# Altium schematic sheet 枪盒主板-20201219.SchDoc
size A1
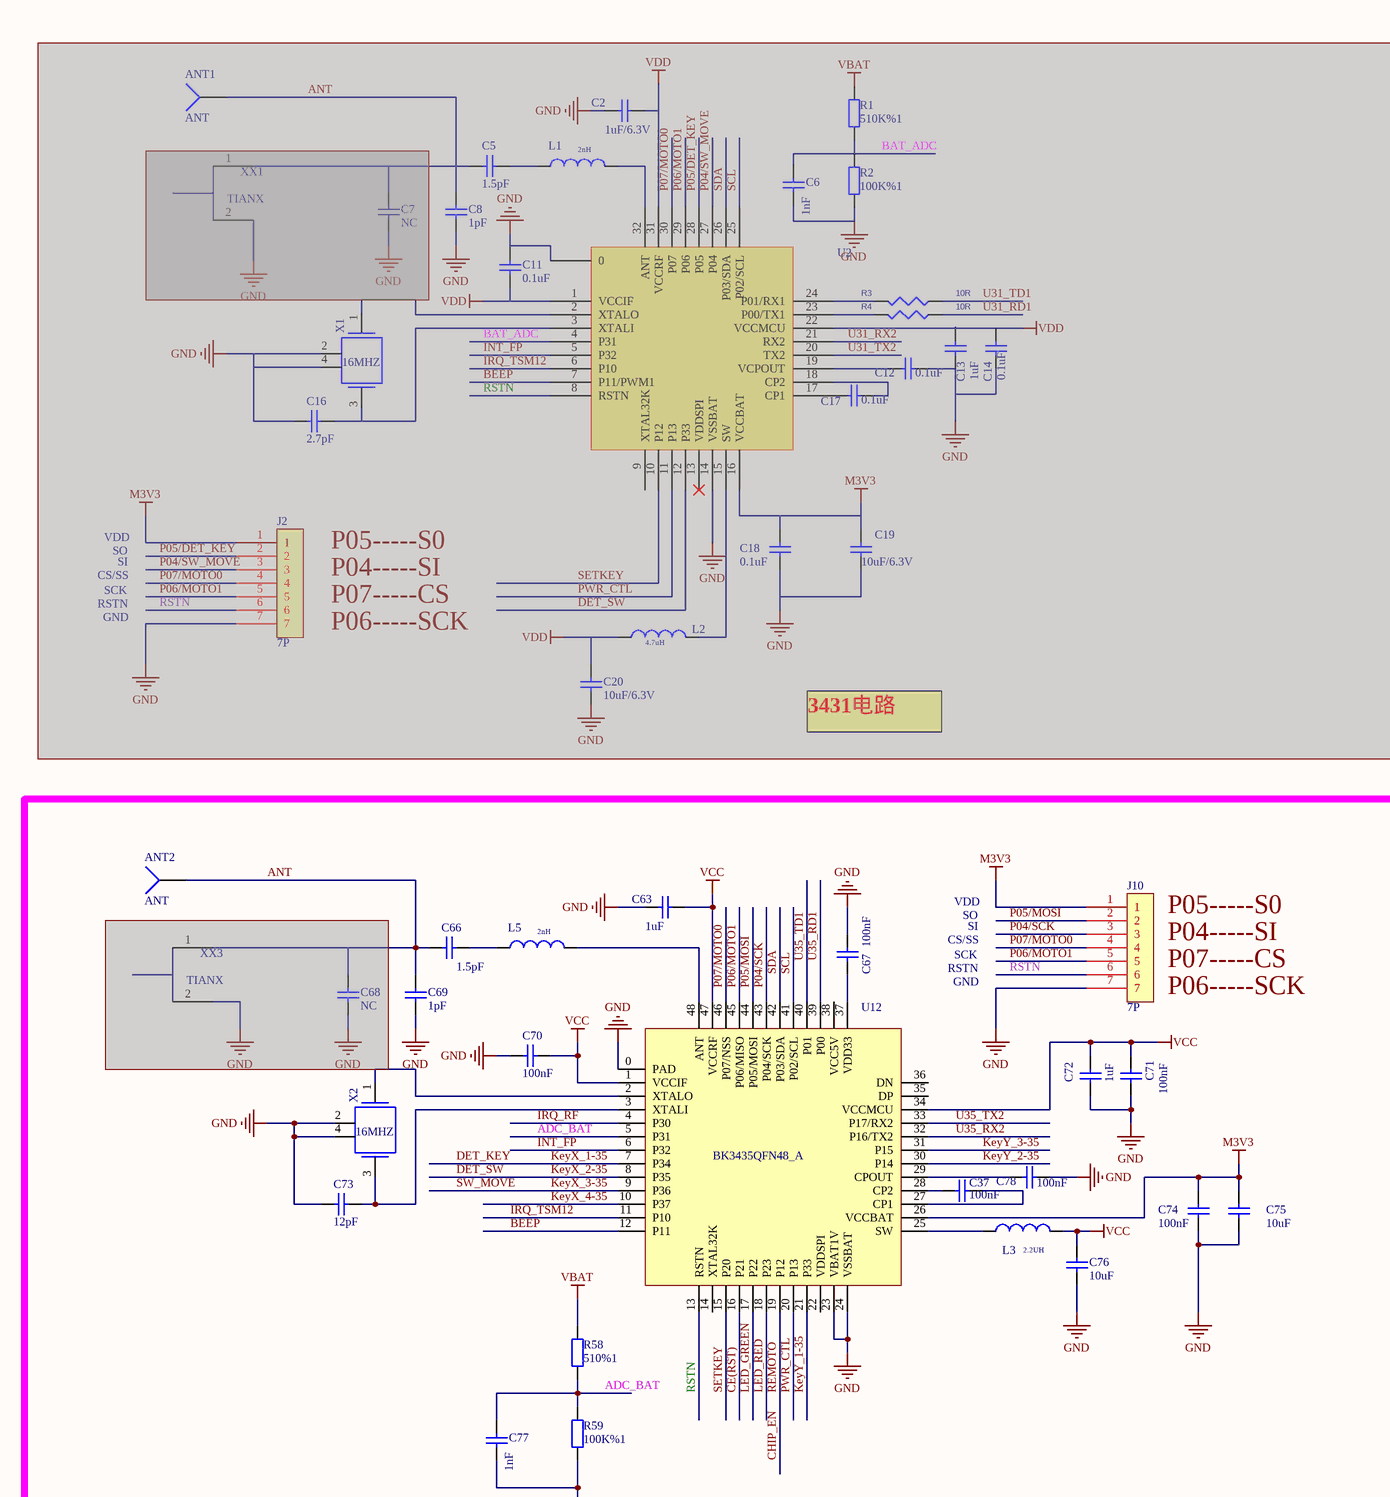
[diagram p0: 枪盒主板-20201219.SchDoc, top left]
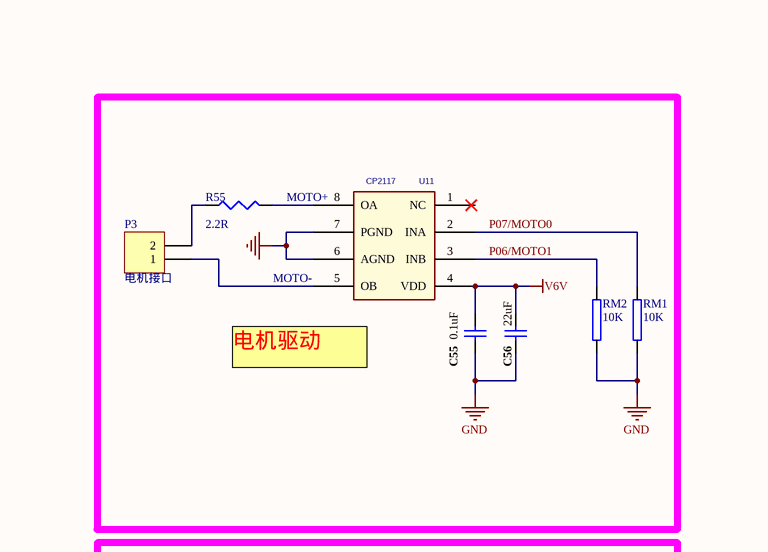
[diagram p1: 枪盒主板-20201219.SchDoc, top right]
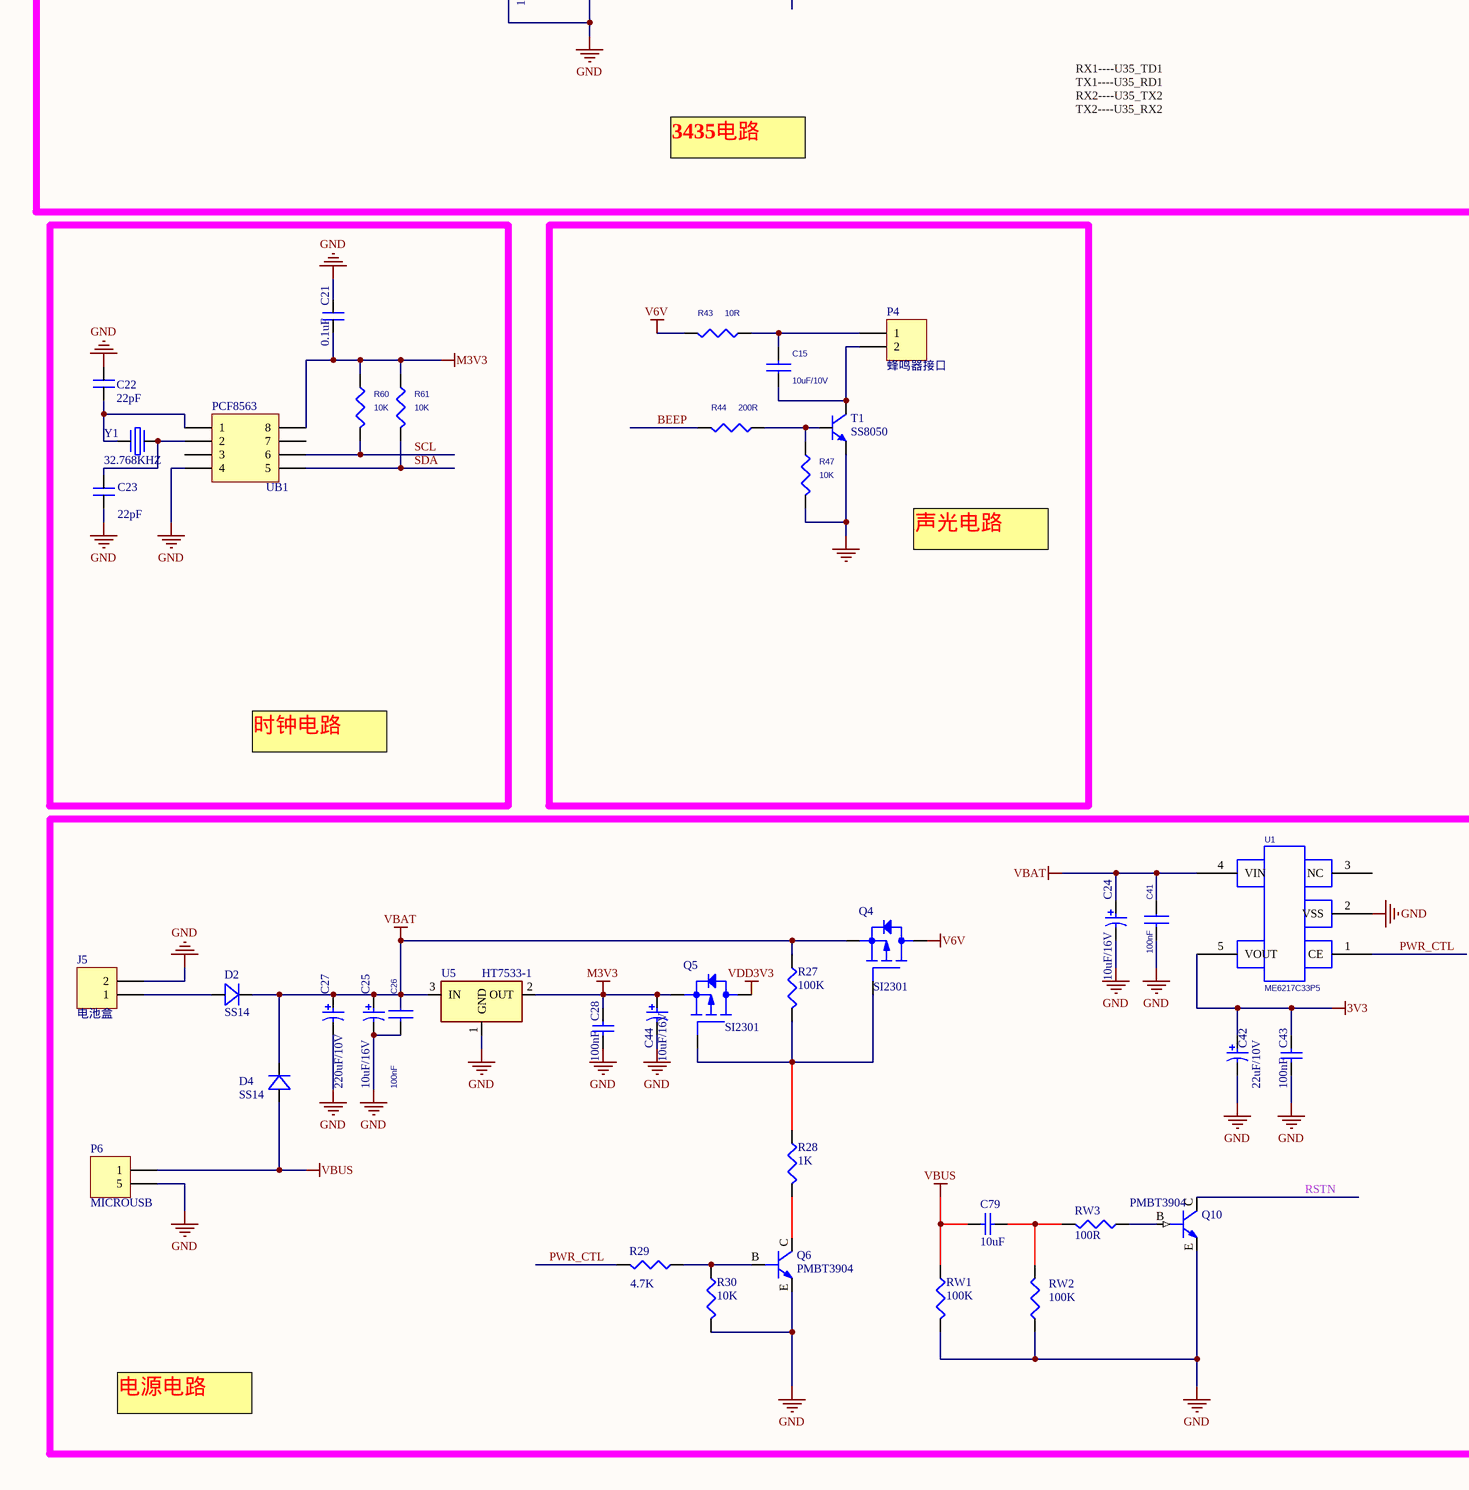
[diagram p2: 枪盒主板-20201219.SchDoc, bottom left]
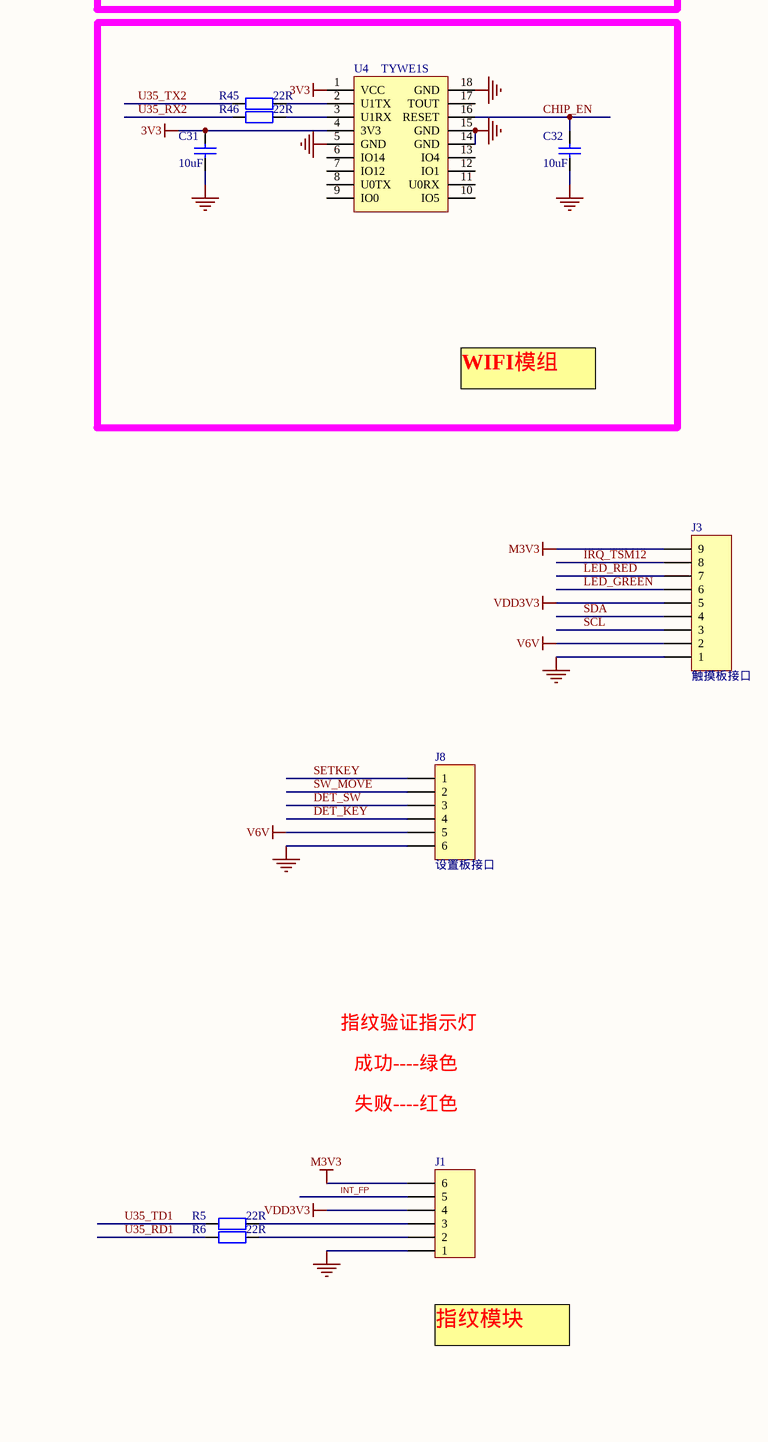
[diagram p3: 枪盒主板-20201219.SchDoc, bottom right]

## Parts
ANT1  ANT  [ANT]  (masked out: inside a compile mask, not in the netlist)
ANT2  ANT  [ANT]
C2  1uF/6.3V  [0603C]  (masked out: inside a compile mask, not in the netlist)
C5  1.5pF  [0603C]  (masked out: inside a compile mask, not in the netlist)
C6  1nF  [0603C]  (masked out: inside a compile mask, not in the netlist)
C7  NC  [0603C]  (masked out: inside a compile mask, not in the netlist)
C8  1pF  [0603C]  (masked out: inside a compile mask, not in the netlist)
C11  0.1uF  [0603C]  (masked out: inside a compile mask, not in the netlist)
C12  0.1uF  [0603C]  (masked out: inside a compile mask, not in the netlist)
C13  1uF  [0603C]  (masked out: inside a compile mask, not in the netlist)
C14  0.1uF  [0603C]  (masked out: inside a compile mask, not in the netlist)
C15  10uF/10V  [0603C]
C16  2.7pF  [0603C]  (masked out: inside a compile mask, not in the netlist)
C17  0.1uF  [0603C]  (masked out: inside a compile mask, not in the netlist)
C18  0.1uF  [0603C]  (masked out: inside a compile mask, not in the netlist)
C19  10uF/6.3V  [0603C]  (masked out: inside a compile mask, not in the netlist)
C20  10uF/6.3V  [0603C]  (masked out: inside a compile mask, not in the netlist)
C21  0.1uF  [0603C]
C22  22pF  [0603C]
C23  22pF  [0603C]
C24  10uF/16V  [0805C]
C25  10uF/16V  [0805C]
C26  100nF  [0603C]
C27  220uF/10V  [0805C]
C28  100nF  [0603C]
C31  10uF  [0603C]
C32  10uF  [0603C]
C37  100nF  [0603C]
C41  100nF  [0603C]
C42  22uF/10V  [0805C]
C43  100nF  [0603C]
C44  10uF/16V  [0805C]
C55  0.1uF  [0603C]
C56  22uF  [0805C]
C63  1uF  [0603C]
C66  1.5pF  [0603C]
C67  100nF  [0603C]
C68  NC  [0603C]  (masked out: inside a compile mask, not in the netlist)
C69  1pF  [0603C]
C70  100nF  [0603C]
C71  100nF  [0603C]
C72  1uF  [0603C]
C73  12pF  [0603C]
C74  100nF  [0603C]
C75  10uF  [0603C]
C76  10uF  [0603C]
C77  1nF  [0603C]
C78  100nF  [0603C]
C79  10uF  [0603C]
D2  SS14  [DO-214AA]
D4  SS14  [DO-214AA]
J1  (no value)  [SM06B-SRSS-TB]
J2  7P  [7P-2.0MM]  (masked out: inside a compile mask, not in the netlist)
J3  触摸板接口  [FPC-0.5-9P]
J5  电池盒  [B2B-PH]
J8  设置板接口  [6P-1mm]
J10  7P  [7P-2.0MM]
L1  2nH  [0603L]  (masked out: inside a compile mask, not in the netlist)
L2  4.7uH  [0603L]  (masked out: inside a compile mask, not in the netlist)
L3  2.2UH  [0603L]
L5  2nH  [0603L]
P3  电机接口  [B2B-PH]
P4  蜂鸣器接口  [B2B-PH]
P6  MICROUSB  [MICRO-USB_F-B]
Q4  SI2301  [SOT-23 - GDS]
Q5  SI2301  [SOT-23 - GDS]
Q6  PMBT3904  [SOT-23 - BCE]
Q10  PMBT3904  [SOT-23 - BCE]
R1  510K%1  [0603R]  (masked out: inside a compile mask, not in the netlist)
R2  100K%1  [0603R]  (masked out: inside a compile mask, not in the netlist)
R3  10R  [0603R]  (masked out: inside a compile mask, not in the netlist)
R4  10R  [0603R]  (masked out: inside a compile mask, not in the netlist)
R5  22R  [0603R]
R6  22R  [0603R]
R27  100K  [0603R]
R28  1K  [0603R]
R29  4.7K  [0603R]
R30  10K  [0603R]
R43  10R  [0603R]
R44  200R  [0603R]
R45  22R  [0603R]
R46  22R  [0603R]
R47  10K  [0603R]
R55  2.2R  [0603R]
R58  510%1  [0603R]
R59  100K%1  [0603R]
R60  10K  [0603R]
R61  10K  [0603R]
RM1  10K  [0603R]
RM2  10K  [0603R]
RW1  100K  [0603R]
RW2  100K  [0603R]
RW3  100R  [0603R]
T1  SS8050  [SOT-23-3L]
U1  ME6217C33P5  [LC-SOT-89-5]
U2  BK3431Q  [QFN32_4*4*0.4]  (value not drawn)  (masked out: inside a compile mask, not in the netlist)
U4  TYWE1S  [WIFI_Module_TYWE1S]
U5  HT7533-1  [SOT-23-3L]
U11  CP2117  [SOP8]
U12  BK3435QFN48_A  [QFN48_6*6*0.4]
UB1  PCF8563  [SOP8]
X1  16MHZ  [XTAL3225]  (masked out: inside a compile mask, not in the netlist)
X2  16MHZ  [XTAL3225]
XX1  TIANX  [BT_NAMI_1]  (masked out: inside a compile mask, not in the netlist)
XX3  TIANX  [BT_NAMI_1]
Y1  32.768KHZ  [晶振-9]

## Nets
3V3: C31.2 C42.1 C43.1 U1.5(VOUT) U4.1(VCC) U4.4(3V3)
GND: C21.2 C22.2 C23.1 C24.2 C25.2 C26.2 C27.2 C28.2 C31.1 C32.1 C41.2 C42.2 C43.2 C44.2 C55.2 C56.2 C63.1 C67.2 C69.1 C70.1 C71.1 C72.1 C73.1 C74.2 C75.2 C76.1 C77.1 C78.2 J1.1 J3.1 J5.2 J8.6 J10.7 P6.5 Q6.E(EMITTER) Q10.E(EMITTER) R30.2 R47.2 R59.2 RM1.1 RM2.1 RW1.2 RW2.1 T1.2 U1.2(VSS) U4.5(GND) U4.14(GND) U4.15(GND) U4.18(GND) U5.1(GND) U11.6(AGND) U11.7(PGND) U12.0(PAD) U12.23(VBAT1V) U12.24(VSSBAT) UB1.4 X2.2 X2.4
M3V3: C21.1 C28.1 C44.1 C74.1 C75.1 J1.6 J3.9 J10.1 Q5.S(SOURCE) R60.1 R61.1 U5.2(OUT) U12.26(VCCBAT) UB1.8
V6V: C55.1 C56.1 J3.2 J8.5 Q4.D(DRAIN) R43.2 U11.4(VDD)
VBAT: C24.1 C25.1 C26.1 C27.1 C41.1 D2.2(K) D4.2(K) Q4.S(SOURCE) R27.1 R58.1 U1.4(VIN) U5.3(IN)
VBUS: C79.1 D4.1(A) P6.1 RW1.1
VCC: C63.2 C70.2 C71.2 C72.2 C76.2 L3.2(P2) U12.1(VCCIF) U12.34(VCCMCU) U12.47(VCCRF)
VDD3V3: J1.4 J3.5 Q5.D(DRAIN)
ADC_BAT: C77.2 R58.2 R59.1 U12.5(P31)
ANT: ANT2.1 C66.2 C69.2 XX3.1
BEEP: R44.2 U12.12(P11)
CE(RST): U12.16(P21)
CHIP_EN: C32.2 U4.16(RESET) U12.19(P12)  [also labelled REMOTO]
DET_KEY: J8.4 U12.7(P34)  [also labelled KeyX_1-35]
DET_SW: J8.3 U12.8(P35)  [also labelled KeyX_2-35]
INT_FP: J1.5 U12.6(P32)
IRQ_RF: U12.4(P30)
IRQ_TSM12: J3.8 U12.11(P10)
KeyX_3-35: J8.2 U12.9(P36)  [also labelled SW_MOVE]
KeyX_4-35: U12.10(P37)
KeyY_1-35: U12.21(P33)
KeyY_2-35: U12.30(P14)
KeyY_3-35: U12.31(P15)
LED_GREEN: J3.6 U12.17(P22)
LED_RED: J3.7 U12.18(P23)
MOTO+: R55.2 U11.8(OA)
MOTO-: P3.1 U11.5(OB)
P04/SCK: J10.3 U12.43(P04/SCK)
P05/MOSI: J10.2 U12.44(P05/MOSI)
P06/MOTO1: J10.5 RM2.2 U11.3(INB) U12.45(P06/MISO)
P07/MOTO0: J10.4 RM1.2 U11.2(INA) U12.46(P07/NSS)
PWR_CTL: R29.2 U1.1(CE) U12.20(P13)
RSTN: J10.6 Q10.C(COLLECTOR) U12.13(RSTN)
SCL: J3.3 R60.2 U12.41(P02/SCL) UB1.6
SDA: J3.4 R61.2 U12.42(P03/SDA) UB1.5
SETKEY: J8.1 U12.15(P20)
U35_RD1: R6.1 U12.39(P00)
U35_RX2: R46.1 U12.32(P16/TX2)
U35_TD1: R5.1 U12.40(P01)
U35_TX2: R45.1 U12.33(P17/RX2)
NetC15_1: C15.1 P4.2 T1.3
NetC15_2: C15.2 P4.1 R43.1
NetC22_1: C22.1 UB1.1 Y1.2
NetC23_2: C23.2 UB1.2 Y1.1
NetC37_1: C37.1 U12.28(CP2)
NetC37_2: C37.2 U12.27(CP1)
NetC66_1: C66.1 L5.1(P1)
NetC67_1: C67.1 U12.37(VDD33)
NetC73_2: C73.2 U12.3(XTALI) X2.3
NetC78_1: C78.1 U12.29(CPOUT)
NetC79_2: C79.2 RW2.2 RW3.2
NetD2_1: D2.1(A) J5.1
NetJ1_2: J1.2 R6.2
NetJ1_3: J1.3 R5.2
NetL3_1: L3.1(P1) U12.25(SW)
NetL5_2: L5.2(P2) U12.48(ANT)
NetP3_2: P3.2 R55.1
NetQ4_G: Q4.G(GATE) Q5.G(GATE) R27.2 R28.1
NetQ6_B: Q6.B(BASE) R29.1 R30.1
NetQ6_C: Q6.C(COLLECTOR) R28.2
NetQ10_B: Q10.B(BASE) RW3.1
NetR44_1: R44.1 R47.1 T1.1
NetR45_2: R45.2 U4.2(U1TX)
NetR46_2: R46.2 U4.3(U1RX)
NetU12_2: U12.2(XTALO) X2.1

Not connected (* = marked no-connect by the designer): U1 3(NC); U4 6(IO14) 7(IO12) 8(U0TX) 9(IO0) 10(IO5) 11(U0RX) 12(IO1) 13(IO4) 17(TOUT); U11 1(NC); U12 14(XTAL32K) 22(VDDSPI) 35(DP) 36(DN) 38(VCC5V); UB1 3 7; XX3 2

## Notes on the sheet
- CS/SS
- VDD
- SO
- SI
- P04-----SI
- P05-----S0
- RSTN
- GND
- SCK
- P06-----SCK
- P07-----CS
- 3431电路
- (near J10) P05-----S0
- (near J10) P04-----SI
- (near J10) P07-----CS
- (near J10) P06-----SCK
- (near U11) 电机驱动
- RX1----U35_TD1
- TX1----U35_RD1
- RX2----U35_TX2
- TX2----U35_RX2
- 3435电路
- WIFI模组
- 声光电路
- 时钟电路
- 指纹验证指示灯
- 成功----绿色
- 失败----红色
- 指纹模块
- 电源电路

## Library data of the parts
ANT1 ANT2 = Socket: LatestRevisionDate: 17-Jul-2002; LatestRevisionNote: Re-released for DXP Platform.; Publisher: Altium Limited
C2 C5 C7 C8 C11-C14 C16-C20 C37 C63 C66-C76 C78 = Cap: Capacitor; Value: 10pF; Published: 8-Jun-2000; LatestRevisionDate: 17-Jul-2002; LatestRevisionNote: Re-released for DXP Platform.; PackageReference: RAD-0.3; Publisher: Altium Limited; PackageDescription: Radial Cap, Thru-Hole; 2 Leads; 0.3 in Pin Spacing
C6 C28 C43 C55 C56 C77 C79 = CAP-NP: Capacitor, Ceramic; Capacitance: 18 pF; Dielectric: COG; Polarity: Non-Polarized; Rated Voltage: 50 mV; Tolerance: 5 %; Category: Capacitor; Mounting Technology: Surface Mount; Status: Unreleased; Technology: Ceramic
C15 = C_0_Dup1
C21-C23 = C
C24 C25 C27 C42 C44 = CAP-P: Capacitor, tolerance ±20%
C26 C41 = CAP NP
C31 C32 = Cap: 10uF/6.3V X5R ±20%; Published: 8-Jun-2000; LatestRevisionDate: 17-Jul-2002; LatestRevisionNote: Re-released for DXP Platform.; PackageReference: RAD-0.3; Publisher: Altium Limited; PackageDescription: Radial Cap, Thru-Hole; 2 Leads; 0.3 in Pin Spacing; Value: 10UF
D2 D4 = D
J1 = Con_SMD_125L_6: Connecter 1.25 SMD lie; Class: Connector; PN: 080101250061; SubClass: 连接器; Model: 1.25 SMD卧式插座
J3 = Header 9: Header,9-Pin; LatestRevisionDate: 17-Jul-2002; LatestRevisionNote: Re-released for DXP Platform.; Publisher: Altium Limited
J5 = Header 2: Header, 2-Pin; LatestRevisionDate: 17-Jul-2002; LatestRevisionNote: Re-released for DXP Platform.; Publisher: Altium Limited
J8 = Header 6: Header, 6-Pin; LatestRevisionDate: 17-Jul-2002; LatestRevisionNote: Re-released for DXP Platform.; Publisher: Altium Limited
L1-L3 L5 = INDUCTOR: Power Inductor, 4.7uH, 0.7A, 260mR DCR; XMOS Part Number: E-09-0011; Manufacturer: Taiyo Yuden; Manufacturer Part Number: CBC2518T4R7M; Part Creator: JG; LEVEL: STD; DEVICE: L; FORWARD_PCB: 1; Tolerance (%): 20; Max DC Resistance: 0.26R; Rated Current (Saturation): 0.68A; Rated Current (Temp Rise): 0.92A; Approx Volume Cost ($): 0.07; Approved: NO; VALUE: 2.0nH; Datasheet: http://www.yuden.co.jp/us/product/pdf/ecb2_e.pdf; Max Height (mm): 2; Digikey Link: http://search.digikey.com/scripts/DkSearch/dksus.dll?lang=en&site=US&keywords=CBC2518T4R7M
P3 P4 P6 = MHDR1X2: Header, 2-Pin; LatestRevisionDate: 17-Jul-2002; LatestRevisionNote: Re-released for DXP Platform.; Publisher: Altium Limited
Q4 Q5 = PWRMOSFET_EP_DGS_0
R1 R2 R58 R59 = Res2: Resistor; Value: 470K; Published: 2013年12月24日; LatestRevisionDate: 2013年12月24日; LatestRevisionNote: Re-released for DXP Platform.
R3 R4 R43 R44 R47 R60 R61 = R_Dup1
R5 R6 R45 R46 = Res2: Resistor; Published: 8-Jun-2000; LatestRevisionDate: 17-Jul-2002; LatestRevisionNote: Re-released for DXP Platform.; PackageReference: AXIAL-0.4; Publisher: Altium Limited; PackageDescription: Axial Device, Thru-Hole; 2 Leads; 0.4 in Pin Spacing; Value: 22r
R27-R30 R55 RW1-RW3 = R
RM1 RM2 = Pro71C3.TMP_UnNamed_1
T1 = NPN_BJT: Bipolar Junction Transistor
U1 = ME6217
U4 = WIFI
U5 = XC6206P302M
U11 = AM24LC02_0
U12 = EFR32BG1-QFN48
UB1 = IC8
X1 X2 = OSC: XMOS Part Number: E-07-0030; Manufacturer: Abracon; Manufacturer Part Number: ABLS-24.000MHz-B4; Part Creator: JG; LEVEL: STD; DEVICE: X; FORWARD_PCB: 1; Approx Volume Cost ($): 0.15; Approved: NO; VALUE: ABLS; FREQUENCY: 38.4MHZ; Datasheet: http://www.abracon.com/Resonators/abls.pdf; Max Height (mm): 4.2; Supplier Link: http://search.digikey.com/scripts/DkSearch/dksus.dll?lang=en&site=US&keywords=ABLS-24.000MHz-B4
Y1 = 晶振